# Altium project racer.PrjPcb
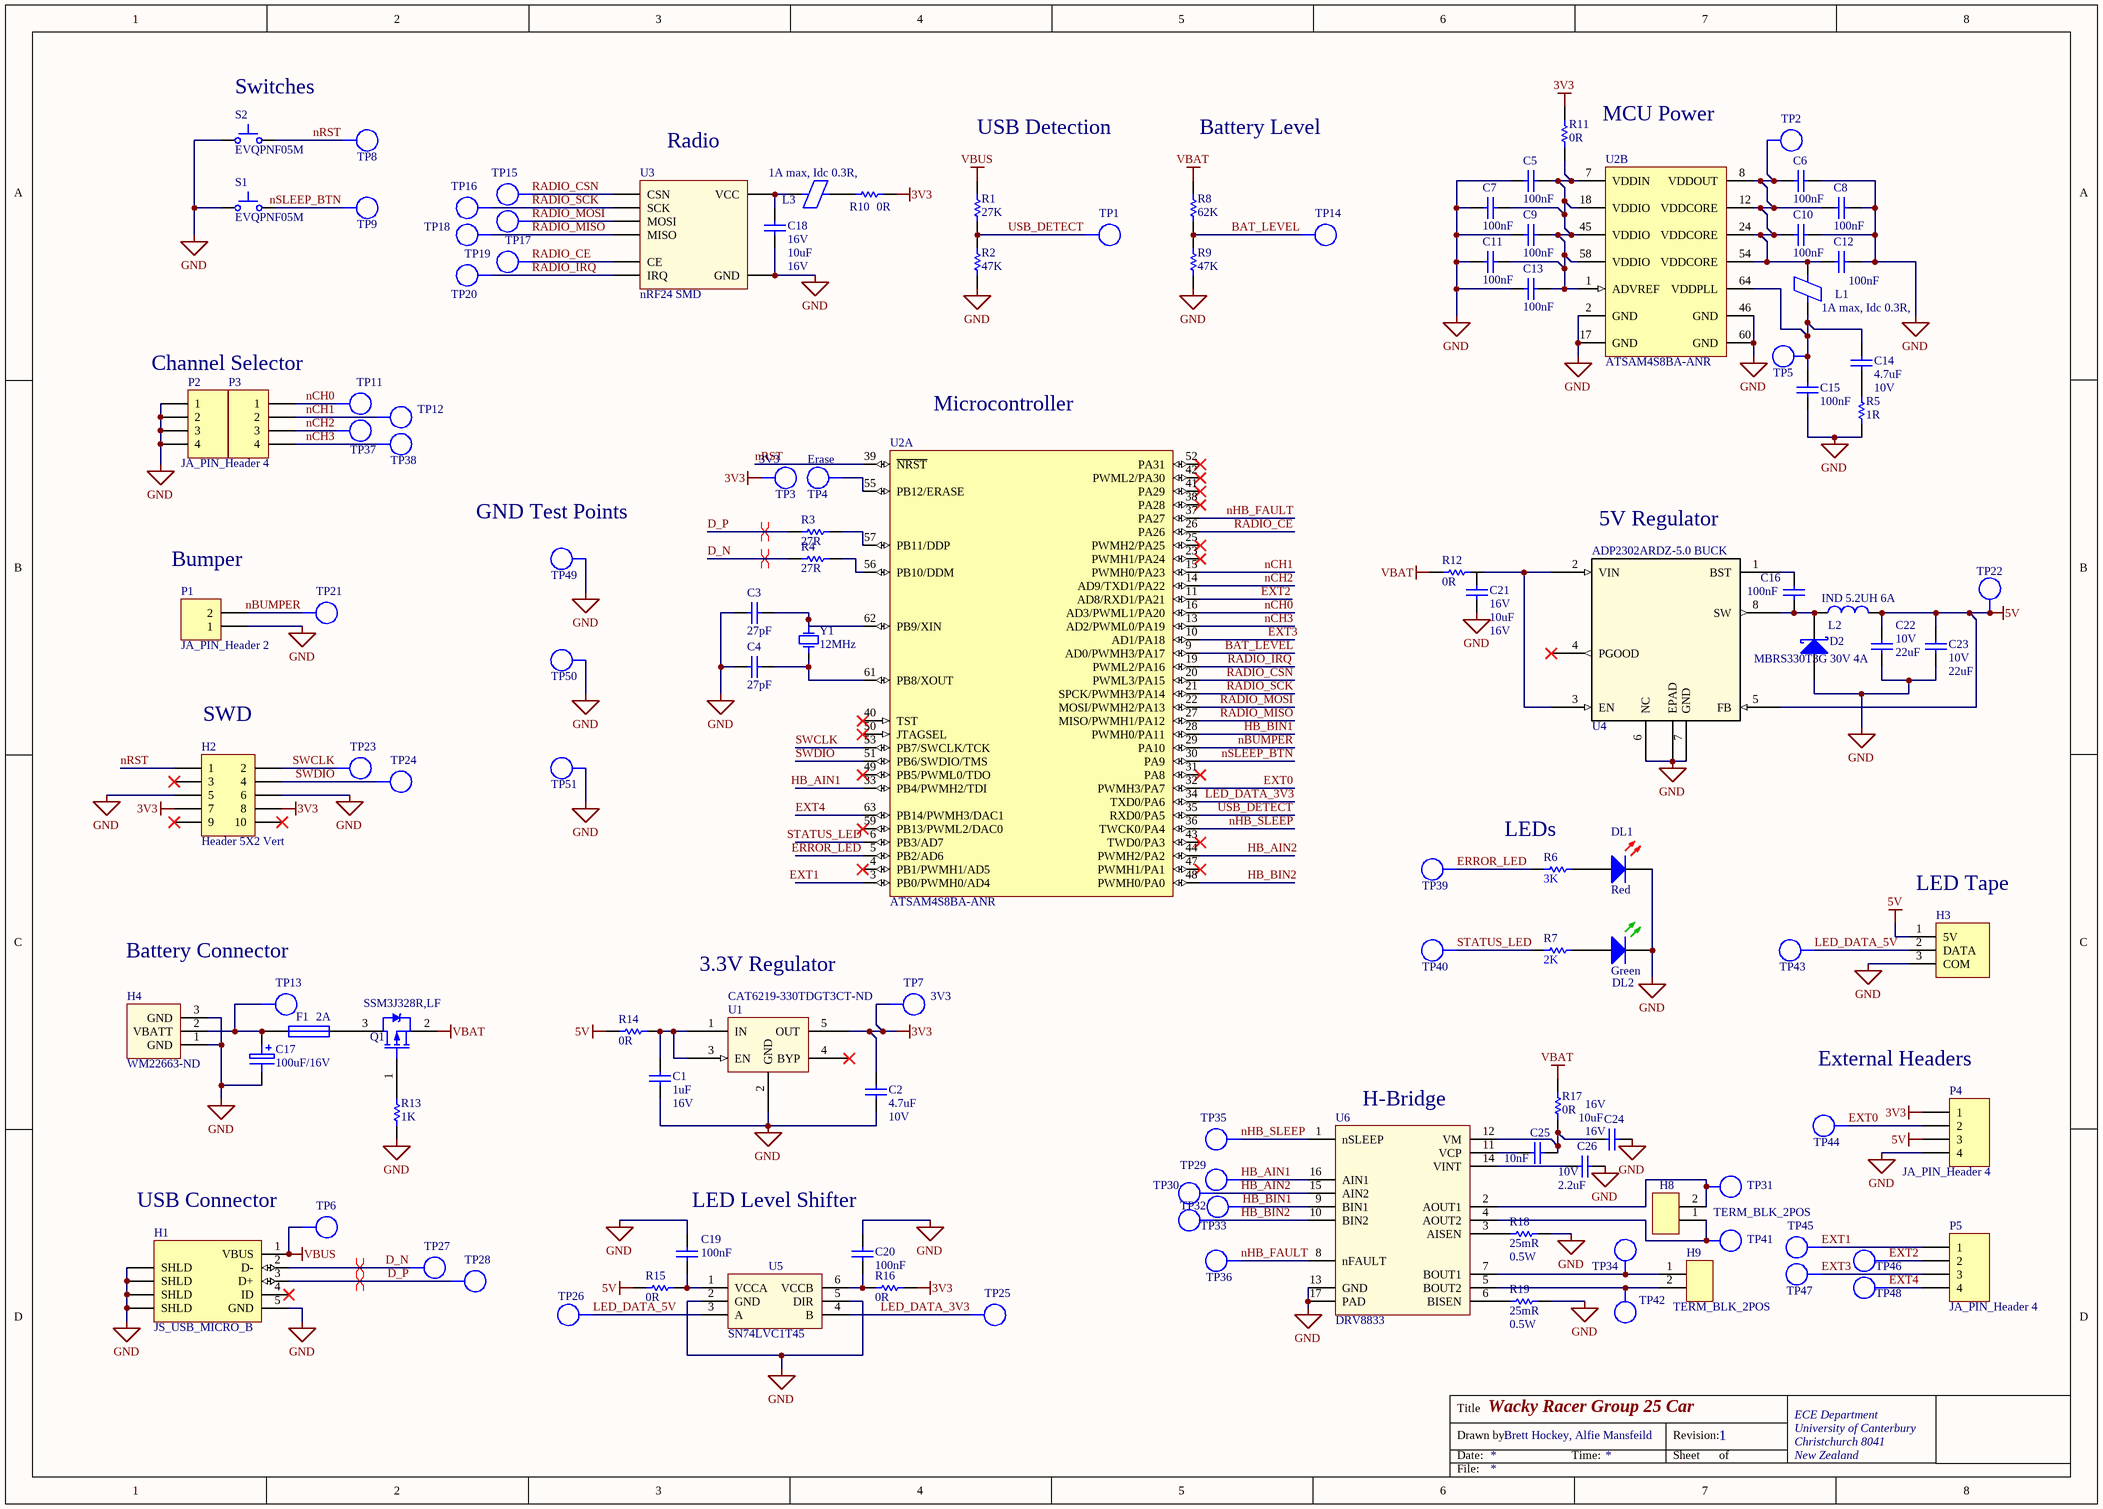
[diagram p0: racer.SchDoc]
1 sheet, 123 parts. Net scope: global (net labels, ports and power ports of the same name join across sheets).
Board file: racer.PcbDoc

## Sheet racer.SchDoc: Wacky Racer Group 25 Car
size A3; DrawnBy: Brett Hockey, Alfie Mansfeild; Address1: ECE Department; Address2: University of Canterbury; Address3: Christchurch 8041; Address4: New Zealand; Revision: 1; ImagePath: \\maxwell\elecapp\AltiumDesigner\Templates\uc-logo.png

### Parts
C1  Max Voltage: 16V  [CAPC1608L]  (hidden comment: 1uF)
C2  Max Voltage: 10V  [CAPC1608N]  (hidden comment: 4.7uF)
C3  27pF  [CAPC1608L]
C4  27pF  [CAPC1608L]
C5  100nF  [CAPC1608L]
C6  100nF  [CAPC1608L]
C7  100nF  [CAPC1608L]
C8  100nF  [CAPC1608L]
C9  100nF  [CAPC1608L]
C10  100nF  [CAPC1608L]
C11  100nF  [CAPC1608L]
C12  100nF  [CAPC1608L]
C13  100nF  [CAPC1608L]
C14  Max Voltage: 10V  [CAPC1608N]  (hidden comment: 4.7uF)
C15  100nF  [CAPC1608L]
C16  100nF  [CAPC1608L]
C17  100uF/16V  [NICH-1]
C18  Voltage - Rated: 16V  [CAPC2012L]  (hidden comment: 10uF)
C19  100nF  [CAPC1608L]
C20  100nF  [CAPC1608L]
C21  Voltage - Rated: 16V  [CAPC2012L]  (hidden comment: 10uF)
C22  Max Voltage: 10V  [CAPC3216L]  (hidden comment: 22uF)
C23  Max Voltage: 10V  [CAPC3216L]  (hidden comment: 22uF)
C24  Voltage - Rated: 16V  [CAPC2012L]  (hidden comment: 10uF)
C25  value 10nF  [CAPC1608L]  (hidden comment: 16V (minimum))
C26  Max Voltage: 10V  [CAPC1608L]  (hidden comment: 2.2uF)
D2  MBRS330T3G 30V 4A  [SMC]
DL1  Red  [WL-SMCW0603]
DL2  Green  [WL-SMCW0603]
F1  2A  [RESC3216N]
H1  JS_USB_MICRO_B  [FCI_USB_10118194-0001LF]
H2  Header 5X2 Vert  [IDC2.54-V10D]
H3  3 Pin Molex KK Hdr  [MOLEX_KK_3_HDR]  (value not drawn)
H4  Supplier Part Number 1: WM22663-ND  [BATT_HEADER_3POS]  (hidden comment: Battery_HEADER_3pin)
H8  TERM_BLK_2POS  [TERM_BLK_2POS]
H9  TERM_BLK_2POS  [TERM_BLK_2POS]
L1  1A max, Idc 0.3R,  [INDC3216L]
L2  IND 5.2UH 6A  [INDUCTOR5u2]
L3  1A max, Idc 0.3R,  [INDC3216L]
P1  JA_PIN_Header 2  [HDR1X2]
P2  JA_PIN_Header 4  [HDR1X4]  (value not drawn)
P3  JA_PIN_Header 4  [HDR1X4]
P4  JA_PIN_Header 4  [HDR1X4]
P5  JA_PIN_Header 4  [HDR1X4]
Q1  SSM3J328R,LF  [SOT23_L]
R1  27K  [RESC1608L]
R2  47K  [RESC1608N]
R3  27R  [RESC1608L]
R4  27R  [RESC1608L]
R5  1R  [RESC3216L]
R6  3K  [RESC1608L]
R7  2K  [RESC1608L]
R8  62K  [RESC1608L]
R9  47K  [RESC1608N]
R10  0R  [RESC1608L]
R11  0R  [RESC1608L]
R12  0R  [RESC1608L]
R13  1K  [RESC1608L]
R14  0R  [RESC1608L]
R15  0R  [RESC1608L]
R16  0R  [RESC1608L]
R17  0R  [RESC1608L]
R18  25mR  Power: 0.5W  [RESC3216N]
R19  25mR  Power: 0.5W  [RESC3216N]
S1  EVQPNF05M  [EVQPNF05M]
S2  EVQPNF05M  [EVQPNF05M]
TP1  3V3  [TP_0603]  (value not drawn)  (no BOM)
TP2  3V3  [TP_0603]  (value not drawn)  (no BOM)
TP3  3V3  [TP_0603]  (no BOM)
TP4  Erase  [TP_0603]  (no BOM)
TP5  3V3  [TP_0603]  (value not drawn)  (no BOM)
TP6  3V3  [TP_0603]  (value not drawn)  (no BOM)
TP7  3V3  [TP_0603]  (no BOM)
TP8  TP  [TP_0603]  (value not drawn)  (no BOM)
TP9  TP  [TP_0603]  (value not drawn)  (no BOM)
TP11  3V3  [TP_0603]  (value not drawn)  (no BOM)
TP12  3V3  [TP_0603]  (value not drawn)  (no BOM)
TP13  3V3  [TP_0603]  (value not drawn)  (no BOM)
TP14  3V3  [TP_0603]  (value not drawn)  (no BOM)
TP15  3V3  [TP_0603]  (value not drawn)  (no BOM)
TP16  3V3  [TP_0603]  (value not drawn)  (no BOM)
TP17  3V3  [TP_0603]  (value not drawn)  (no BOM)
TP18  3V3  [TP_0603]  (value not drawn)  (no BOM)
TP19  3V3  [TP_0603]  (value not drawn)  (no BOM)
TP20  3V3  [TP_0603]  (value not drawn)  (no BOM)
TP21  3V3  [TP_0603]  (value not drawn)  (no BOM)
TP22  3V3  [TP_0603]  (value not drawn)  (no BOM)
TP23  3V3  [TP_0603]  (value not drawn)  (no BOM)
TP24  3V3  [TP_0603]  (value not drawn)  (no BOM)
TP25  3V3  [TP_0603]  (value not drawn)  (no BOM)
TP26  3V3  [TP_0603]  (value not drawn)  (no BOM)
TP27  3V3  [TP_0603]  (value not drawn)  (no BOM)
TP28  3V3  [TP_0603]  (value not drawn)  (no BOM)
TP29  TP  [TP_0603]  (value not drawn)  (no BOM)
TP30  TP  [TP_0603]  (value not drawn)  (no BOM)
TP31  TP  [TP_0603]  (value not drawn)  (no BOM)
TP32  TP  [TP_0603]  (value not drawn)  (no BOM)
TP33  TP  [TP_0603]  (value not drawn)  (no BOM)
TP34  TP  [TP_0603]  (value not drawn)  (no BOM)
TP35  TP  [TP_0603]  (value not drawn)  (no BOM)
TP36  TP  [TP_0603]  (value not drawn)  (no BOM)
TP37  3V3  [TP_0603]  (value not drawn)  (no BOM)
TP38  3V3  [TP_0603]  (value not drawn)  (no BOM)
TP39  3V3  [TP_0603]  (value not drawn)  (no BOM)
TP40  3V3  [TP_0603]  (value not drawn)  (no BOM)
TP41  TP  [TP_0603]  (value not drawn)  (no BOM)
TP42  TP  [TP_0603]  (value not drawn)  (no BOM)
TP43  3V3  [TP_0603]  (value not drawn)  (no BOM)
TP44  3V3  [TP_0603]  (value not drawn)  (no BOM)
TP45  3V3  [TP_0603]  (value not drawn)  (no BOM)
TP46  3V3  [TP_0603]  (value not drawn)  (no BOM)
TP47  3V3  [TP_0603]  (value not drawn)  (no BOM)
TP48  3V3  [TP_0603]  (value not drawn)  (no BOM)
TP49  TP  [TP_1206]  (value not drawn)  (no BOM)
TP50  TP  [TP_1206]  (value not drawn)  (no BOM)
TP51  TP  [TP_1206]  (value not drawn)  (no BOM)
U1  Supplier Part Number: CAT6219-330TDGT3CT-ND  [SOT95P280X145-5N]  (hidden comment: CAT6219-330TDGT3)
U2  ATSAM4S8BA-ANR  [LQFP64_L]  (parts A,B of 2)
U3  nRF24 SMD  [NRF24]
U4  ADP2302ARDZ-5.0 BUCK  [RD_8_1]
U5  SN74LVC1T45  [SOT23-6_N]
U6  DRV8833  [HTSOP16 DRV8833]
Y1  12MHz  [6.0X3.5-4]

### Nets
3V3: C2.2 H2.7 H2.8 P4.1 R10.2 R11.2 R16.2 TP3.1 TP7.1 U1.5(OUT)
5V: C22.2 C23.2 H3.1(5V) L2.2 P4.3 R14.1 R15.1 TP22.1 U4.5(FB)
GND: C1.1 C2.1 C3.1 C4.1 C5.1 C6.1 C7.1 C8.1 C9.1 C10.1 C11.1 C12.1 C13.1 C15.2 C17.1 C18.1 C19.1 C20.1 C21.1 C22.1 C23.1 C24.1 C26.2 D2.1(A) DL1.1(K) DL2.1(K) H1.5(GND) H1.6(SHLD) H2.5 H2.6 H3.3(COM) H4.1(GND) H4.3(GND) P1.1 P2.1 P2.2 P2.3 P2.4 P4.4 R2.1 R5.1 R9.1 R13.1 R18.2 R19.2 S1.1 S2.1 TP49.1 TP50.1 TP51.1 U1.2(GND) U2.2(GND) U2.17(GND) U2.46(GND) U2.60(GND) U3.2(GND) U4.6(NC) U4.7(GND) U4.EPAD U5.2(GND) U5.5(DIR) U6.13(GND) U6.17(PAD)
VBAT: Q1.2 R8.2 R12.1 R17.2
VBUS: H1.1(VBUS) R1.2 TP6.1
BAT_LEVEL: R8.1 R9.2 TP14.1 U2.9(AD0/PWMH3/PA17)
D_N: H1.2(D-) R4.1 TP27.1
D_P: H1.3(D+) R3.1 TP28.1
ERROR_LED: R6.1 TP39.1 U2.5(PB2/AD6)
EXT0: P4.2 TP44.1 U2.32(PWMH3/PA7)
EXT1: P5.1 TP45.1 U2.3(PB0/PWMH0/AD4)
EXT2: P5.2 TP46.1 U2.11(AD8/RXD1/PA21)
EXT3: P5.3 TP47.1 U2.10(AD1/PA18)
EXT4: P5.4 TP48.1 U2.63(PB14/PWMH3/DAC1)
HB_AIN1: TP29.1 U2.33(PB4/PWMH2/TDI) U6.16(AIN1)
HB_AIN2: TP30.1 U2.44(PWMH2/PA2) U6.15(AIN2)
HB_BIN1: TP32.1 U2.28(PWMH0/PA11) U6.9(BIN1)
HB_BIN2: TP33.1 U2.48(PWMH0/PA0) U6.10(BIN2)
LED_DATA_3V3: TP25.1 U2.34(TXD0/PA6) U5.4(B)
LED_DATA_5V: H3.2(DATA) TP26.1 TP43.1 U5.3(A)
nBUMPER: P1.2 TP21.1 U2.29(PA10)
nCH0: P3.1 TP11.1 U2.16(AD3/PWML1/PA20)
nCH1: P3.2 TP12.1 U2.15(PWMH0/PA23)
nCH2: P3.3 TP37.1 U2.14(AD9/TXD1/PA22)
nCH3: P3.4 TP38.1 U2.13(AD2/PWML0/PA19)
nHB_FAULT: TP36.1 U2.37(PA27) U6.8(nFAULT)
nHB_SLEEP: TP35.1 U2.36(TWCK0/PA4) U6.1(nSLEEP)
nRST: H2.1 S2.2 TP8.1 U2.39(~{NRST})
nSLEEP_BTN: S1.2 TP9.1 U2.30(PA9)
RADIO_CE: TP19.1 U2.26(PA26) U3.3(CE)
RADIO_CSN: TP15.1 U2.20(PWML3/PA15) U3.4(CSN)
RADIO_IRQ: TP20.1 U2.19(PWML2/PA16) U3.8(IRQ)
RADIO_MISO: TP18.1 U2.27(MISO/PWMH1/PA12) U3.7(MISO)
RADIO_MOSI: TP17.1 U2.22(MOSI/PWMH2/PA13) U3.6(MOSI)
RADIO_SCK: TP16.1 U2.21(SPCK/PWMH3/PA14) U3.5(SCK)
STATUS_LED: R7.1 TP40.1 U2.6(PB3/AD7)
SWCLK: H2.2 TP23.1 U2.53(PB7/SWCLK/TCK)
SWDIO: H2.4 TP24.1 U2.51(PB6/SWDIO/TMS)
USB_DETECT: R1.1 R2.2 TP1.1 U2.35(RXD0/PA5)
NetC1_2: C1.2 R14.2 U1.1(IN) U1.3(EN)
NetC3_2: C3.2 U2.62(PB9/XIN) Y1.3(OSC2)
NetC4_2: C4.2 U2.61(PB8/XOUT) Y1.1(OSC1)
NetC5_2: C5.2 C7.2 C9.2 C11.2 C13.2 R11.1 U2.1(ADVREF) U2.7(VDDIN) U2.18(VDDIO) U2.45(VDDIO) U2.58(VDDIO)
NetC6_2: C6.2 C8.2 C10.2 C12.2 L1.2 TP2.1 U2.8(VDDOUT) U2.12(VDDCORE) U2.24(VDDCORE) U2.54(VDDCORE)
NetC14_1: C14.1 R5.2
NetC14_2: C14.2 C15.1 L1.1 TP5.1 U2.64(VDDPLL)
NetC16_1: C16.1 D2.2(K) L2.1 U4.8(SW)
NetC16_2: C16.2 U4.1(BST)
NetC17_2: C17.2 F1.1 H4.2(VBATT) TP13.1
NetC18_2: C18.2 L3.1 U3.1(VCC)
NetC19_2: C19.2 R15.2 U5.1(VCCA)
NetC20_2: C20.2 R16.1 U5.6(VCCB)
NetC24_2: C24.2 C25.2 R17.1 U6.12(VM)
NetC25_1: C25.1 U6.11(VCP)
NetC26_1: C26.1 U6.14(VINT)
NetDL1_2: DL1.2(A) R6.2
NetDL2_2: DL2.2(A) R7.2
NetF1_2: F1.2 Q1.3
NetH8_1: H8.1 TP41.1 U6.4(AOUT2)
NetH8_2: H8.2 TP31.1 U6.2(AOUT1)
NetH9_1: H9.1 TP34.1 U6.7(BOUT1)
NetH9_2: H9.2 TP42.1 U6.5(BOUT2)
NetL3_2: L3.2 R10.1
NetQ1_1: Q1.1 R13.2
NetR3_2: R3.2 U2.57(PB11/DDP)
NetR4_2: R4.2 U2.56(PB10/DDM)
NetR12_2: R12.2 U4.2(VIN) U4.3(EN)
NetR18_1: R18.1 U6.3(AISEN)
NetR19_1: R19.1 U6.6(BISEN)
NetTP4_1: TP4.1 U2.55(PB12/ERASE)

Not connected (* = marked no-connect by the designer): C21 2; H1 4(ID)*; H2 3* 9* 10*; U1 4(BYP)*; U2 4(PB1/PWMH1/AD5)* 23(PWMH1/PA24)* 25(PWMH2/PA25)* 31(PA8)* 38(PA28)* 40(TST)* 41(PA29)* 42(PWML2/PA30)* 43(TWD0/PA3)* 47(PWMH1/PA1)* 49(PB5/PWML0/TDO)* 50(JTAGSEL)* 52(PA31)* 59(PB13/PWML2/DAC0)*; U4 4(PGOOD)*

### Layout directives
differential pair: D_N, D_P

### Notes on the sheet
- Switches
- MCU Power
- (near U3) Radio
- USB Detection
- Battery Level
- Channel Selector
- (near U2) Microcontroller
- (near TP49) GND Test Points
- (near U4) 5V Regulator
- (near P1) Bumper
- (near H2) SWD
- (near R6) LEDs
- (near H3) LED Tape
- Battery Connector
- 3.3V Regulator
- External Headers
- (near U6) H-Bridge
- USB Connector
- LED Level Shifter
- Title
- Drawn by:
- Date:
- Time:
- Revision:
- Sheet
- of
- File:

### Library data of the parts
C1 = CC_1uF_0603: CAP CER 1uF Y5V -20% +80% 16V 0603; PackageReference: 0603; Code_IPC: 1608 [0603]; Verify: *; Supplier: ECE Dept; Storage Location: PCB Assembly WS; Value: 1uF
C2 C14 = CC_4.7uF_0603: CAP CER 4.7uF X5R +-20%  10V 0603; Note: Footprint corresponds to dimensions for bulk cassette packaging. This case size has tightened tolerances.; PackageReference: 0805; Code_IPC: 2012[0805]; Verify: *; Supplier: ECE Dept; Storage Location: PCB Assembly WS; Value: 4.7uF
C3 C4 = CC_27pF_0603: CAP CER 27pF NPO/COG +-5% 50V 0603; PackageReference: 0603; Code_IPC: 1608 [0603]; Verify: *; Supplier: ECE Dept; Storage Location: PCB Assembly WS; Value: 27pF
C5-C13 C15 C16 C19 C20 = CC_100nF_0603: CAP CER 100nF X7R +-10% 50V 0603; PackageReference: 0603; Code_IPC: 1608 [0603]; Verify: *; Supplier: ECE Dept; Storage Location: PCB Assembly WS; Value: 100nF
C17 = CA_100uF_16V: CAP ALUM 100uF 16V SMD; Manufacturer PN: UWX1C101MCL1GB; Manufacturer: Nichcon; Supplier 1: Farnell; Supplier Part Number 1: 1870677; Storage Location: PCB Assembly WS; Supplier: ECE Dept; Supplier 2: Digi-Key; Supplier Part Number 2: 493-2105-1-ND; Value: 100uF/16V
C18 C21 C24 = CC_10uF_0805_16V: CAP CER 10uF X5R 16V 0805; Manufacturer: Samsung Electro-Mechanics; Manufacturer Part Number: CL21A106KOQNNWE; Note: Footprint corresponds to dimensions for bulk cassette packaging. This case size has tightened tolerances.; Tolerance: ±10%; Notification: Current market demand for these product types have resulted in fluctuating and extending lead times. Lead times may differ.; PackageReference: 0805; Code_IPC: 2012[0805]; Supplier 1: Digi-Key; RoHS: RoHS Compliant; Category: Capacitors; Stock 1: 20000; Pricing 1: 1=0.35, 10=0.25, 100=0.1178, 500=0.08254, 1000=0.06831 (NZD); Packaging: Cut Tape (CT); Part Status: Active; Temperature Coefficient: X5R; Operating Temperature: -55°C ~ 85°C; Features: -; Ratings: -; Applications: General Purpose; Mounting Type: Surface Mount, MLCC; Package / Case: 0805 (2012 Metric); Size / Dimension: 0.079" L x 0.049" W (2.00mm x 1.25mm); Height - Seated (Max): -; Thickness (Max): 0.055" (1.40mm); Lead Spacing: -; Lead Style: -; ComponentLink1URL: http://www.samsungsem.com/kr/support/product-search/mlcc/CL21A106KOQNNWE.jsp; ComponentLink1Description: http://www.samsungsem.com/kr/support/product-search/mlcc/CL21A106KOQNNWE.jsp; Supplier Part Number 1: 1276-2894-1-ND; Value: 10uF; Max Voltage: 16V
C22 C23 = CC_22uF_1206: CAP CER 22uF Y5V -20% +80% 10V 1206; Verify: *; Supplier: ECE Dept; Storage Location: PCB Assembly WS; Dielectric: Y5V; Footprint: 1206 (3216 metric); Value: 22uF
C25 = CC_10nF_0603: CAP CER 10nF X7R +-10% 50V 0603; PackageReference: 0603; Code_IPC: 1608 [0603]; Verify: *; Supplier: ECE Dept; Storage Location: PCB Assembly WS
C26 = CC_2.2uF_0603: CAP CER 2.2uF X5R +-20% 10V 0603; PackageReference: 0603; Code_IPC: 1608 [0603]; Verify: *; Supplier: ECE Dept; Storage Location: PCB Assembly WS; Value: 2.2uF
D2 = MBRS330T3G: SCHOTTKY  30V 4A; Manufacturer: ON Semiconductor; Speed: Fast Recovery =< 500ns, > 200mA (Io); Supplier 1: Digi-Key; Manufacturer Part Number: MBRS330T3G; RoHS: RoHS Compliant; Category: Discrete Semiconductor Products; Stock 1: 8919; Pricing 1: 1=0.93, 10=0.79, 100=0.5902, 500=0.46368, 1000=0.35829 (NZD); Packaging: Cut Tape (CT); Part Status: Active; Diode Type: Schottky; Current - Average Rectified (Io): 4A; Capacitance @ Vr, F: -; Mounting Type: Surface Mount; Package / Case: DO-214AB, SMC; Supplier Device Package: SMC; Operating Temperature - Junction: -65°C ~ 150°C; Base Part Number: MBRS330; ComponentLink1URL: http://www.onsemi.com/pub/Collateral/MBRS340T3-D.PDF; ComponentLink1Description: http://www.onsemi.com/pub/Collateral/MBRS340T3-D.PDF; Supplier Part Number 1: MBRS330T3GOSCT-ND
DL1 = DL_150060RS75000: LED Red 250mcd 0603 SMD; Manufacturer: WURTH ELEKTRONIK; Forward Current If: 30; Forward Voltage: 2; Lens Shape: Rectangular; Luminous Intensity: 250; Wavelength Typ: 625; Viewing Angle: 140°; LED Mounting: SMD; Supplier 1: Farnell; Supplier Part Number 1: 2322071; Manufacturer Part Number: 150060RS75000; Storage Location: PCB Assembly WS; Supplier: ECE Dept; LED Colour: Red
DL2 = DL_150060GS75000: LED Green 430mcd 0603 SMD; Manufacturer: WURTH ELEKTRONIK; Forward Current If: 30; Wavelength Typ: 520; Forward Voltage: 3.2; Lens Shape: Rectangular; Luminous Intensity: 430; Viewing Angle: 140°; LED Mounting: SMD; Supplier 1: Farnell; Supplier Part Number 1: 2322070; Manufacturer Part Number: 150060GS75000; Storage Location: PCB Assembly WS; Supplier: ECE Dept; LED Colour: Green
F1 = FS_Fuse_2.0A: Fuse 2.0A Very Fast Acting 1206 SMD; Manufacturer: MULTICOMP; Manufacturer PN: MC12CF 002; Supplier: ECE Dept; Storage Location: PCB Assembly WS; Supplier 1: Farnell; Supplier Part Number 1: 1841029; Manufacturer Part Number: MC12CF 002; Value: 2A
H1 = JS_USB_MICRO_B_SMT: CONN USB MICRO B RECPT SMT R/A; Manufacturer: FCI; Manufacturer Part Number: 10118194-0001LF; Gender: Receptacle; Number of Contacts: 5; Specifications: USB 2.0; Supplier 1: Digi-Key; Supplier Part Number 1: 609-4618-1-ND; Features: Shielded, Solder Retention; Mounting Type: Surface Mount, Right Angle, Horizontal
H2 = JA_HDR_IDC_5X2_VERT: IDC Header, 2,54mm, 10-Pin, Vert; Supplier: ECE Dept; Supplier 1: Farnell; Supplier Part Number 1: 1096985; Storage Location: ECE Dept Store
H3 = LED_Strip_Header: CONN HEADER 3POS 2.54mm VERT_Thru Hole; Manufacturer: Molex; Manufacturer PN: 22-23-2031; Supplier Part Number 1: 9731156; Supplier: ECE Dept; Supplier 1: Farnell; Storage Location: ECE Dept Store; Value: 3 Pin Molex KK Hdr
H4 = Battery_HEADER_3pin: 3Pin Header 2.54mm spacing / Digikey #WM22663-ND; Supplier 1: Digi-Key
H8 H9 = TERM_BLK_2POS: 2 Position Terminal Block 7.62mm spacing
L1 L3 = IN_Ferrite-Bead: Ferrite Bead, Rdc 0.3R, Z100MHZ 600R, Imax 1A, SMD 1206; Manufacturer: FAIR-RITE; Manufacturer PN: 2512066017Y1; DC Current Rating: 1; DC Resistance Max: 0.08; Ferrite Case Style: 1206 ^3216 Metric]; Frequency Range: 50MHz to 1; Impedance: 600; Impedance Tolerance: ± 25%; Supplier: ECE Dept; Storage Location: PCB Assembly WS; Ferrite Mounting: SMD; Supplier 1: Farnell; Supplier Part Number 1: 1612060; Manufacturer Part Number: 2512066017Y1; Value: 1A max, Idc 0.3R,
L2 = CDRH104RNP-5R2NC: FIXED IND 5.2UH 6A 22 MOHM SMD; Manufacturer: Sumida America Components Inc.; Material - Core: Ferrite; Tolerance: ±30%; Current - Saturation: 5.6A; Shielding: Shielded; DC Resistance (DCR): 22 mOhm Max; Supplier 1: Digi-Key; Manufacturer Part Number: CDRH104RNP-5R2NC; RoHS: RoHS Compliant; Category: Inductors, Coils, Chokes; Stock 1: 3849; Pricing 1: 1=2.9, 10=2.678, 100=1.8743, 500=1.5173 (NZD); Packaging: Cut Tape (CT); Part Status: Active; Type: -; Q @ Freq: -; Frequency - Self Resonant: -; Ratings: -; Operating Temperature: -40°C ~ 100°C; Mounting Type: Surface Mount; Package / Case: Nonstandard; Supplier Device Package: -; Size / Dimension: 0.402" L x 0.394" W (10.20mm x 10.00mm); Height - Seated (Max): 0.157" (4.00mm); ComponentLink1URL: http://products.sumida.com/products/pdf/CDRH104R.pdf; ComponentLink1Description: http://products.sumida.com/products/pdf/CDRH104R.pdf; Supplier Part Number 1: 308-2280-1-ND
P1 = JA_PIN_Header 2: Header, 2-Pin; LatestRevisionDate: 17-Jul-2002; LatestRevisionNote: Re-released for DXP Platform.; Publisher: Altium Limited
P2-P5 = JA_PIN_Header 4: Header, 4-Pin; LatestRevisionDate: 17-Jul-2002; LatestRevisionNote: Re-released for DXP Platform.; Publisher: Altium Limited
Q1 = TM_SSM3J328R: MOSFET P-CH 20V 6A SOT23-3; Manufacturer: Toshiba; FET Feature: Logic Level Gate, 1.5V Drive; FET Type: MOSFET P-Channel, Metal Oxide; Gate Charge (Qg) @ Vgs: 12.8nC @ 4.5V; Input Capacitance (Ciss) @ Vds: 840pF @ 10V; Power - Max: 1W; Rds On Max: 29.8mR; Drain to Source Resistance: 47.4mR; Turn-On Delay Time: 32ns; Power Dissipation: 2W; Number of Channels: 1; Turn-Off Delay Time: 107ns; Gate to Source Voltage (Vgs): 8V; Input Capacitance: 840pF; Element Configuration: Single; Drain to Source Breakdown Voltage: -20V; Vgs(th) (Max) @ Id: 1V @ 1mA; Current - Continuous Drain (Id) @ 25° C: 6A; Drain to Source Voltage (Vdss): 20V; Package / Case: SOT-23-3 Flat Leads; Supplier Device Package: SOT-23F; Pricing: 1=0.79, 10=0.658, 25=0.5772, 100=0.4939, 250=0.42836, 500=0.36284, 1000=0.27972 (NZD); Storage Location: PCB Assembly WS; Supplier: Digi-Key; ComponentLink1URL: https://datasheet.ciiva.com/11158/ssm3j328r-datasheet-en-20140301-11158652.pdf; ComponentLink1Description: https://datasheet.ciiva.com/11158/ssm3j328r-datasheet-en-20140301-11158652.pdf; Supplier Part Number: SSM3J328RLFDKR-ND; Max Operating Temperature: 150°C; Mount: Surface Mount; Packaging: Tape and Reel; Min Operating Temperature: -55°C; Continuous Drain Current (ID): 6A; Radiation Hardening: No; Max Power Dissipation: 1W; Package Quantity: 3000; Case/Package: SOT-23-3; Number of Pins: 3; Number of Elements: 1; Supplier 1: Digi-Key; Supplier Part Number 1: SSM3J328RLFDKR-ND; Manufacturer Part Number: SSM3J328R,LF
R1 = RS_27K: RES 27K OHM 1/10W 5% 0603 SMD; Storage Location: PCB Assembly WS; Supplier: ECE Dept; Value: 27K
R2 R9 = RS_47K: RES 47.0K OHM 1/10W 5% 0603 SMD; Storage Location: PCB Assembly WS; Supplier: ECE Dept; Value: 47K
R3 R4 = RS_27R: RES 27 OHM 1/10W 5% 0603 SMD; Storage Location: PCB Assembly WS; Supplier: ECE Dept; Value: 27R
R5 = RT_1R: RES 1R OHM 1/4W 5% 1206 SMD; Storage Location: PCB Assembly WS; Supplier: ECE Dept; Value: 1R
R6 = RS_3K: RES 3K OHM 1/10W 5% 0603 SMD; Storage Location: PCB Assembly WS; Supplier: ECE Dept; Value: 3K
R7 = RS_2K: RES 2K OHM 1/10W 5% 0603 SMD; Storage Location: PCB Assembly WS; Supplier: ECE Dept; Value: 2K
R8 = RS_62K: RES 62.0K OHM 1/10W 5% 0603 SMD; Storage Location: PCB Assembly WS; Supplier: ECE Dept; Value: 62K
R10-R12 R14-R17 = RS_0R0: RES 0.0 OHM 1/10W 5% 0603 SMD; Storage Location: PCB Assembly WS; Supplier: ECE Dept; Value: 0R
R13 = RS_1K: RES 1.0K OHM 1/10W 5% 0603 SMD; Storage Location: PCB Assembly WS; Supplier: ECE Dept; Value: 1K
R18 R19 = RS_25mR: 0.5W 1206 25mR Resistor
S1 S2 = WS_EVQPNF05M: Panasonic 6 x 3.5mm SMD Light Touch Switch Type SMD; PackageDescription: 6.0 x 3.5 mm; Supplier 1: Farnell; Supplier Part Number 1: 2079481; Manufacturer: Panasonic; Manufacturer PN: EVQPNF05M; Supplier 2: Digi-Key; Supplier Part Number 2: P13598SCT-ND; Storage Location: PCB Assembly WS; Supplier: ECE Dept
TP1-TP7 TP11-TP28 TP37-TP40 TP43-TP48 = TP_1206: Test-Point 3.3x1.6x2.1mm SMD; Manufacturer: Harwin Inc; Manufacturer Part Number: S1751-46R; Value: TP; Manufacturer PN: *; Storage Location: ProtoPlace; Mounting Type: Surface Mount; Type: PC Test Point; Supplier 1: Digi-Key; Supplier Part Number 1: 952-1478-2-ND; Supplier 2: Farnell; Supplier Part Number 2: 1826282; Supplier: ECE Dept
TP8 TP9 TP29-TP36 TP41 TP42 TP49-TP51 = TP_1206: Test-Point 3.3x1.6x2.1mm SMD; Manufacturer: Harwin Inc; Manufacturer Part Number: S1751-46R; Mounting Type: Surface Mount; Type: PC Test Point; Supplier 1: Digi-Key; Supplier Part Number 1: 952-1478-2-ND; Manufacturer PN: *; Storage Location: ProtoPlace; Supplier 2: Farnell; Supplier Part Number 2: 1826282; Supplier: ECE Dept; Value: TP
U1 = SV_CAT6219-330TDGT3: IC REG LIN 3.3V 500MA TSOT23-5; Voltage - Input (Max): 5.5V; Voltage Dropout (Max): 0.5V @ 500mA; Manufacturer Part Number: CAT6219-330TDGT3; Base Part Number: CAT6219; Current - Output: 500mA; Package / Case: SOT-23-5 Thin, TSOT-23-5; Supplier: Digi-Key; Supplier Device Package: TSOT-23-5; Voltage - Output (Min/Fixed): 3.3V; ComponentLink1URL: http://www.onsemi.com/pub/Collateral/CAT6219-D.PDF; ComponentLink1Description: http://www.onsemi.com/pub/Collateral/CAT6219-D.PDF; Supplier 1: Digi-Key
U2 = SE_ATSAM4S16BA-MU: IC MCU 32BIT 512KB FLASH 64LQFP; Manufacturer: Atmel; Connectivity: I²C, IrDA, Memory Card, SPI, SSC, UART/USART, USB; Core Processor: ARM® Cortex®-M4; Core Size: 32-Bit; Data Converters: A/D 11x12b, D/A 2x12b; Number of I/O: 47; Peripherals: Brown-out Detect/Reset, DMA, POR, PWM, WDT; Program Memory Size: 512KB (512K x 8); RAM Size: 128K x 8; Speed: 120MHz; Voltage - Supply (Vcc/Vdd): 1.62 V ~ 3.6 V; PackageVersion: revJ, Jul-2007; PackageReference: 64PS; PackageDescription: 64-Pin Quad Flat No-Lead (QFN) Sawn, 9 x 9 x 1.0 mm Body, 0.5 mm Pitch, Exposed Pad; Code_JEDEC: MO-220VMMD-3; ComponentLink1Description: Manufacturer URL; ComponentLink1URL: http://www.atmel.com/; ComponentLink2Description: SAM4S Series Datasheet; ComponentLink2URL: http://www.atmel.com/dyn/resources/prod_documents/11100.pdf; ComponentLink3Description: SAM4S Series Summary; ComponentLink3URL: http://www.atmel.com/dyn/resources/prod_documents/11100S.pdf; Supplier 1: Digi-Key; Package / Case: 64-LQFP; Packaging: Cut Tape (CT); Program Memory Type: FLASH; Supplier Part Number 1: ATSAM4S8BA-ANRCT-ND; Manufacturer Part Number: ATSAM4S8BA-ANR
U3 = NRF24: nRF24 SMD Module; Warning: No power planes near or under device
U4 = ADP2302ARDZ-5.0-R7: IC REG BUCK 5V 2A 8SOIC; Vendor: Analog Devices Inc; Frequency - Switching: 700kHz; Output Type: Fixed; Voltage - Input (Max): 20V; Manufacturer_Part_Number: ADP2302ARDZ-5.0-R7; Type: DEV; Value: Value; Supplier 1: Digi-Key; Current - Output: 2A; Voltage - Output (Min/Fixed): 5V; Supplier Part Number 1: ADP2302ARDZ-5.0-R7CT-ND
U5 = SN74LVC1T45: 1.8V - 5V level converter
U6 = DRV8833: Dual H-Bridge Motor Driver 1.5A
Y1 = XT_CRYSTAL_12MHz_18pF: CRYSTAL 12MHZ 18PF 6X3.5mm SMD; Manufacturer: CTS-Frequency Controls; Manufacturer Part Number: 406C35D12M00000; ESR (Equivalent Series Resistance): 60 Ohm; Frequency Stability: ±50ppm; Frequency Tolerance: ±30ppm; Operating Mode: Fundamental; Supplier 1: Digi-Key; Height: 0.047" (1.20mm); Load Capacitance: 18pF; Mounting Type: Surface Mount; Operating Temperature: -20°C ~ 70°C; Package / Case: 4-SMD, No Lead (DFN, LCC); Size / Dimension: 0.236" L x 0.138" W (6.00mm x 3.50mm); Supplier Part Number 1: CTX855CT-ND; Frequency: 12MHz